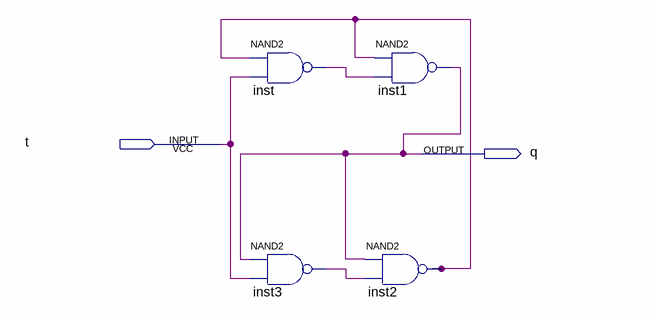
[diagram p0: schematic sheet]
// Quartus schematic t_flipflop.bdf as structural Verilog: 4 symbols, 2 pins
module t_flipflop (
  input  t,
  output q
);

  wire inst2_out, inst3_out, inst_out;

  nand inst (inst_out, inst2_out, t);
  nand inst3 (inst3_out, q, t);
  nand inst1 (q, inst2_out, inst_out);
  nand inst2 (inst2_out, q, inst3_out);
endmodule
